# EAGLE design logicboard (EAGLE 6.6.0)
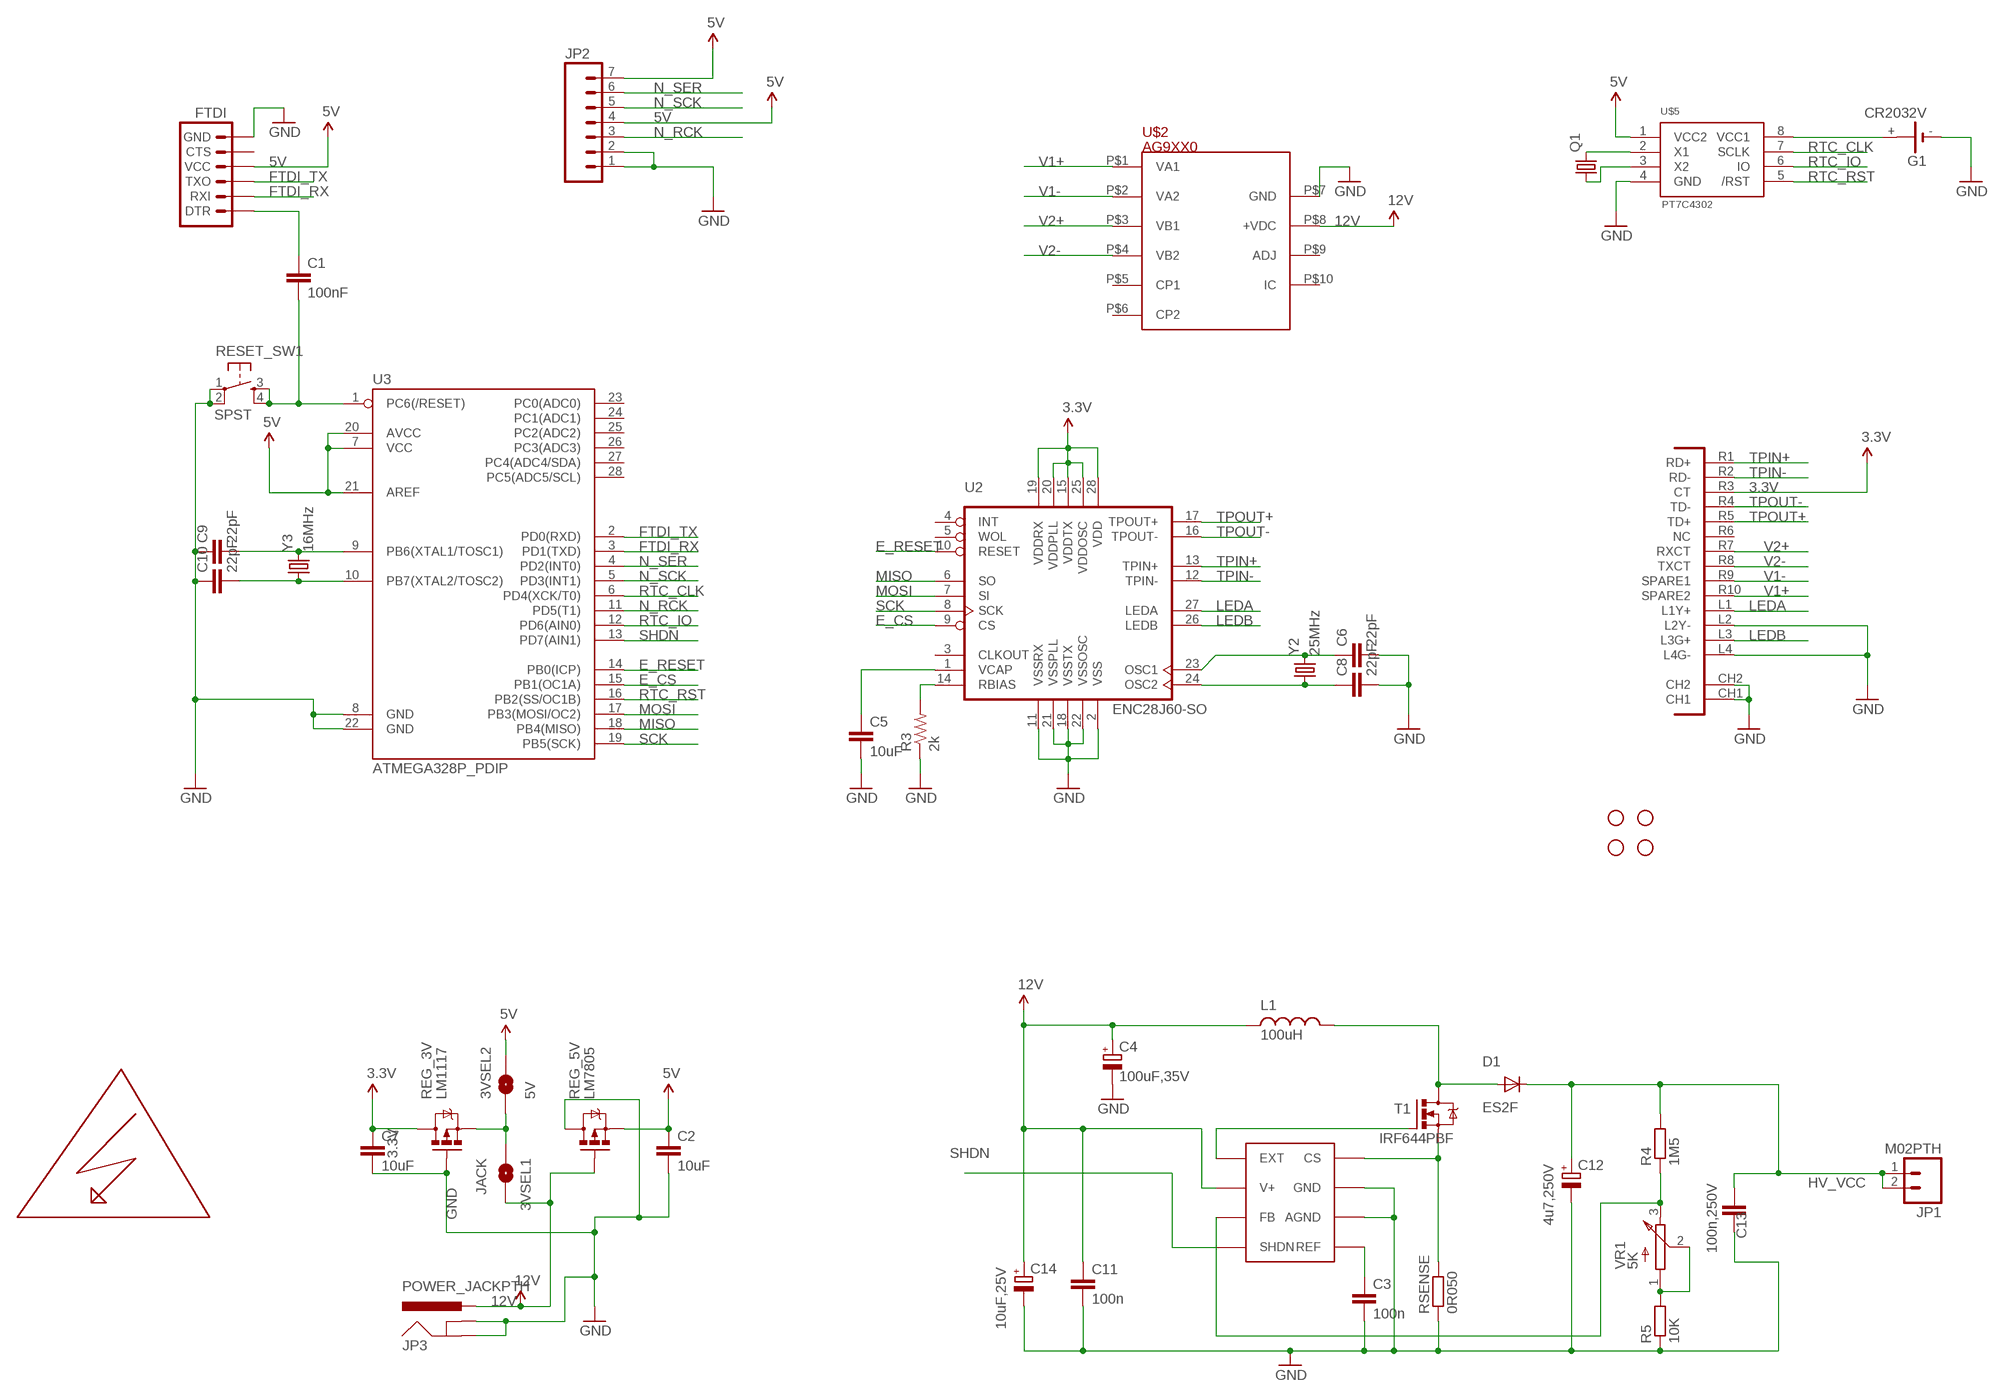
[diagram p0: schematic, sheet 1]

## Parts
3VSEL1  JACK  JUMPER-PAD-2-NOROUND  [PAD-JUMPER-2-NO_YES_SILK_ROUND]
3VSEL2  5V  JUMPER-PAD-2-NOROUND  [PAD-JUMPER-2-NO_YES_SILK_ROUND]
C1  100nF  CAPPTH  [CAP-PTH-SMALL]
C2  10uF  CAPPTH  [CAP-PTH-SMALL]
C3  100n  C-EUC0805  [C0805]
C4  100uF,35V  C-POL-EU7343  [C-EIA-7343]
C5  10uF  CAPPTH  [CAP-PTH-SMALL]
C6  22pF  CAPPTH  [CAP-PTH-SMALL]
C7  10uF  CAPPTH  [CAP-PTH-SMALL]
C8  22pF  CAPPTH  [CAP-PTH-SMALL]
C9  22pF  CAPPTH  [CAP-PTH-SMALL]
C10  22pF  CAPPTH  [CAP-PTH-SMALL]
C11  100n  C-EUC0805  [C0805]
C12  4u7,250V  C-POL-EU-NICHICON-UJ-12  [NICHICON-UJ-12]
C13  100n,250V  C-EU-2420  [C2420]
C14  10uF,25V  C-POL-EU7343  [C-EIA-7343]
D1  ES2F  DIODE-SMC  [SMC]
FTDI  ARDUINO_SERIAL_PROGRAMPTH  [1X06]
G1  CR2032V  [CR2032V]
JP1  M02PTH  [1X02]
JP2  M07  [1X07]
JP3  POWER_JACKPTH  [POWER_JACK_PTH]
L1  100uH  L-SMT-POWER-B82479  [L-B82479]
Q1  CRYSTALTC26V  [TC26V]
R3  2k  RESISTORPTH-1/4W-VERT  [AXIAL-0.1]
R4  1M5  R-EU_R2512  [R2512]
R5  10K  R-EU_R0805  [R0805]
REG_3V  LM1117  MOSFET-PCHANNELFQP27P06  [TO220V]
REG_5V  LM7805  MOSFET-PCHANNELFQP27P06  [TO220V]
RESET_SW1  SPST  TACTILE-SWITCH-PTH  [TAC-SWITCH-PTH]
RSENSE  0R050  R-EU_R2010  [R2010]
STANDOFF1  STAND-OFF  [STAND-OFF]
STANDOFF2  STAND-OFF  [STAND-OFF]
STANDOFF3  STAND-OFF  [STAND-OFF]
STANDOFF4  STAND-OFF  [STAND-OFF]
T1  IRF644PBF  IRF740  [TO220BV]
U2  ENC28J60-SO  [SO28W]
U3  ATMEGA328P_PDIP  [DIL28-3]
U$1  MAX1771  [8-DIP]
U$2  AG9XX0  [AG9000]
U$3  POE-RJ45  [POE-RJ45]
U$4  HIGHVOLTAGE  [HIGHVOLTAGE]
U$5  PT7C4302  [SO8]
VR1  5K  TRIMPOT-3214W  [BOURNS-3214W]
Y2  25MHz  CRYSTALHC49US  [HC49US]
Y3  16MHz  CRYSTALHC49US  [HC49US]

## Nets
3.3V: C7.1 REG_3V.2(D) U2.15(VDDTX) U2.19(VDDRX) U2.20(VDDPLL) U2.25(VDDOSC) U2.28(VDD) U$3.R3(CT)
5V: 3VSEL2.2 C2.1 FTDI.4(VCC) JP2.4 JP2.7 REG_5V.3(S) U3.7(VCC) U3.20(AVCC) U3.21(AREF) U$5.1(VCC2)
12V [power]: 3VSEL1.2 C4.+ C11.1 C14.+ JP3.PWR L1.P$1 REG_5V.1(G) U$1.V+ U$2.P$8(+VDC)
E_CS: U2.9(CS) U3.15(PB1(OC1A))
E_RESET: U2.10(RESET) U3.14(PB0(ICP))
EXT: T1.G U$1.EXT
FTDI_RX: FTDI.2(RXI) U3.3(PD1(TXD))
FTDI_TX: FTDI.3(TXO) U3.2(PD0(RXD))
GND: C2.2 C3.2 C4.- C5.2 C6.2 C7.2 C8.2 C9.1 C10.1 C11.2 C12.1(-) C13.P$2 C14.- FTDI.6(GND) G1.- JP2.1 JP2.2 JP3.GND JP3.GNDBREAK R3.P$1 R5.1 REG_3V.1(G) REG_5V.2(D) RESET_SW1.1 RESET_SW1.2 RSENSE.1 U2.2(VSS) U2.11(VSSRX) U2.18(VSSTX) U2.21(VSSPLL) U2.22(VSSOSC) U3.8(GND) U3.22(GND) U$1.AGND U$1.GND U$2.P$7(GND) U$3.CH1 U$3.CH2 U$3.L2(L2Y-) U$3.L4(L4G-) U$5.4(GND)
HV_VCC [power]: C12.2(+) C13.P$1 D1.C JP1.1 JP1.2 R4.2
LEDA: U2.27(LEDA) U$3.L1(L1Y+)
LEDB: U2.26(LEDB) U$3.L3(L3G+)
MISO: U2.6(SO) U3.18(PB4(MISO))
MOSI: U2.7(SI) U3.17(PB3(MOSI/OC2))
N$1: 3VSEL1.1 3VSEL2.1 REG_3V.3(S)
N$2: G1.+ U$5.8(VCC1)
N$3: R3.P$2 U2.14(RBIAS)
N$4: C5.1 U2.1(VCAP)
N$5: C6.1 U2.23(OSC1) Y2.2
N$6: C8.1 U2.24(OSC2) Y2.1
N$7: R5.2 VR1.1(A) VR1.2(W)
N$8: R4.1 U$1.FB VR1.3(B)
N$9: RSENSE.2 T1.S U$1.CS
N$10: C3.1 U$1.REF
N$11: Q1.2 U$5.2(X1)
N$12: Q1.1 U$5.3(X2)
N$15 [power]: D1.A L1.P$2 T1.D
N$20: C9.2 U3.9(PB6(XTAL1/TOSC1)) Y3.2
N$21: C10.2 U3.10(PB7(XTAL2/TOSC2)) Y3.1
N$37: C1.1 FTDI.1(DTR)
N_RCK: JP2.3 U3.11(PD5(T1))
N_SCK: JP2.5 U3.5(PD3(INT1))
N_SER: JP2.6 U3.4(PD2(INT0))
RESET: C1.2 RESET_SW1.3 RESET_SW1.4 U3.1(PC6(/RESET))
RTC_CLK: U3.6(PD4(XCK/T0)) U$5.7(SCLK)
RTC_IO: U3.12(PD6(AIN0)) U$5.6(IO)
RTC_RST: U3.16(PB2(SS/OC1B)) U$5.5(/RST)
SCK: U2.8(SCK) U3.19(PB5(SCK))
SHDN: U3.13(PD7(AIN1)) U$1.SHDN
TPIN+: U2.13(TPIN+) U$3.R1(RD+)
TPIN-: U2.12(TPIN-) U$3.R2(RD-)
TPOUT+: U2.17(TPOUT+) U$3.R5(TD+)
TPOUT-: U2.16(TPOUT-) U$3.R4(TD-)
V1+: U$2.P$1(VA1) U$3.R10(SPARE2)
V1-: U$2.P$2(VA2) U$3.R9(SPARE1)
V2+: U$2.P$3(VB1) U$3.R7(RXCT)
V2-: U$2.P$4(VB2) U$3.R8(TXCT)
Unconnected: FTDI.5(CTS) G1.+@1(+) U2.3(CLKOUT) U2.4(INT) U2.5(WOL) U3.23(PC0(ADC0)) U3.24(PC1(ADC1)) U3.25(PC2(ADC2)) U3.26(PC3(ADC3)) U3.27(PC4(ADC4/SDA)) U3.28(PC5(ADC5/SCL)) U$2.P$5(CP1) U$2.P$6(CP2) U$2.P$9(ADJ) U$2.P$10(IC) U$3.R6(NC)

## Library data of the parts
3VSEL1 3VSEL2 = SparkFun-Passives:JUMPER-PAD-2-NO
C1 C2 C5-C10 = SparkFun-Capacitors:CAP: Capacitor Standard 0603 ceramic capacitor, and 0.1" leaded capacitor.
C3 C11 = rcl:C-EU: CAPACITOR, European symbol
C4 C14 = nick:C-POL-EU7343: Capacitor, Tantalum, EU 7343 case, polarised
C12 = nick:C-POL-EU: Capacitor, Tantalum, EU 7343 case, polarised
C13 = nick:C-EU
D1 = diode:DIODE-: DIODE
FTDI = SparkFun-Connectors:ARDUINO_SERIAL_PROGRAM: FTDI connector footprints
G1 = battery:CR2032V: LI BATTERY Varta
JP1 = SparkFun-Connectors:M02: Standard 2-pin 0.1" header. Use with - straight break away headers ( PRT-00116) - right angle break away headers (PRT-00553) - swiss pins (PRT-00743) - machine pins (PRT-00117) - female headers (PRT-00115) Molex polarized connector foot print use with: PRT-08233 with associated crimp pins and housings. 2.54_SCREWTERM for use with PRT-10571. 3.5mm Screw Terminal footprints for PRT-08084 5mm Screw Terminal footprints for use with PRT-08432
JP2 = SparkFun-Connectors:M07: Header 7 Standard 7-pin 0.1" header. Use with straight break away headers (SKU : PRT-00116), right angle break away headers (PRT-00553), swiss pins (PRT-00743), machine pins (PRT-00117), and female headers (PRT-00115). NOTES ON THE VARIANTS LOCK and LOCK_LONGPADS... This footprint was designed to help hold the alignment of a through-hole component (i.e. 7-pin header) while soldering it into place. You may notice that each hole has been shifted either up or down by 0.005 of an inch from it's more standard position (which is usually a perfectly straight line). This slight alteration caused the pins (the squares in the middle) to touch the edges of the holes. Because they are alternating, it causes a "brace" to hold the header in place. 0.005 has proven to be the perfect amount of "off-center" position when using our standard breakaway headers. Although looks a little odd when you look at the bare footprint, once you have a header in there, the alteration is very hard to notice. Also, if you push a header all the way into place, it is covered up entirely on the bottom side. This idea of altering the position of holes to aid alignment will be further integrated into the Sparkfun Library for other footprints. It can help hold any component with 3 or more connection pins.
JP3 = SparkFun-Connectors:POWER_JACK: Power Jack This is the standard 5.5mm barrel jack for power. The PTH is the most common, proven, reliable, footprint. The Slot footprint only works if the mill layer is transmitted to the PCB fab house so be warned. Mating wall wart : TOL-00298 (and others); PROD_ID: CONN-08197
L1 = nick:L-SMT-POWER: SMT power inductors
Q1 = crystal:CRYSTAL: CRYSTAL; OC_FARNELL: unknown; OC_NEWARK: unknown
R3 = SparkFun-Resistors:RESISTOR: Resistor Basic schematic elements and footprints for 0603, 1206, and PTH resistors.
R4 R5 RSENSE = rcl:R-EU_: RESISTOR, European symbol
REG_3V REG_5V = User-Submitted:MOSFET-PCHANNEL: Generic PMOSFET IRLML2244 - TRANS-11153 (SOT-23 -20V -4.3A) (1.Gate 2.Source 3.Drain) FQP27P06 - COM-10349 <http://www.sparkfun.com/products/10349> (TO-220 -60V -27A) (1.Gate 2.Source 3.Drain)
RESET_SW1 = GeekAmmo:TACTILE-SWITCH: Tactile Switch 4 Pins, SPST NO
STANDOFF1-STANDOFF4 = SparkFun-Electromechanical:STAND-OFF: #4 Stand Off This is the mechanical footprint for a #4 phillips button head screw. Use the keepout ring to avoid running the screw head into surrounding components. SKU : PRT-00447
T1 = transistor-power:IRF740: N-CHANNEL MOS FET
U2 = microchip-enc28j60:ENC28J60-*: Microchip 10Mbit Eth. contoller with SPI interface
U3 = SparkFun-DigitalIC:ATMEGA328P_PDIP: uC used in the Arduino 32kb flash, 1k EEPROM, 2k SRAM This is the through-hole version of this chip.
U$1 = max1771:MAX1771
U$2 = SmartPrj:AG9XX0: PoE module
U$3 = SmartPrj:POE-RJ45
U$4 = highvoltage:HIGHVOLTAGE
U$5 = Custom:PT7C4302
VR1 = nick:TRIMPOT
Y2 Y3 = SparkFun-FreqCtrl:CRYSTAL: Various standard crystals. Proven footprints.

## Net classes
1 power: width 0.762 mm, clearance 0.508 mm

## Board
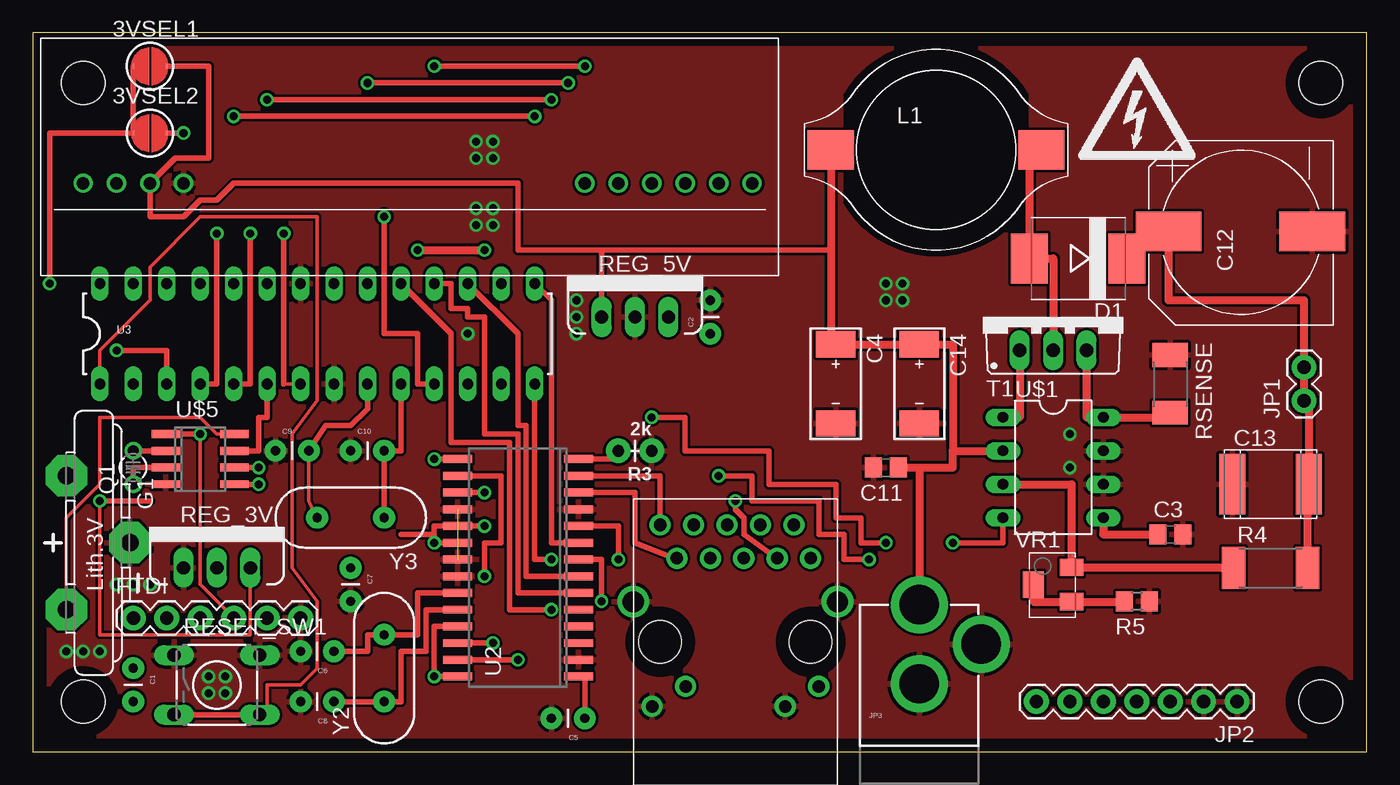
[diagram p1: board, top side]
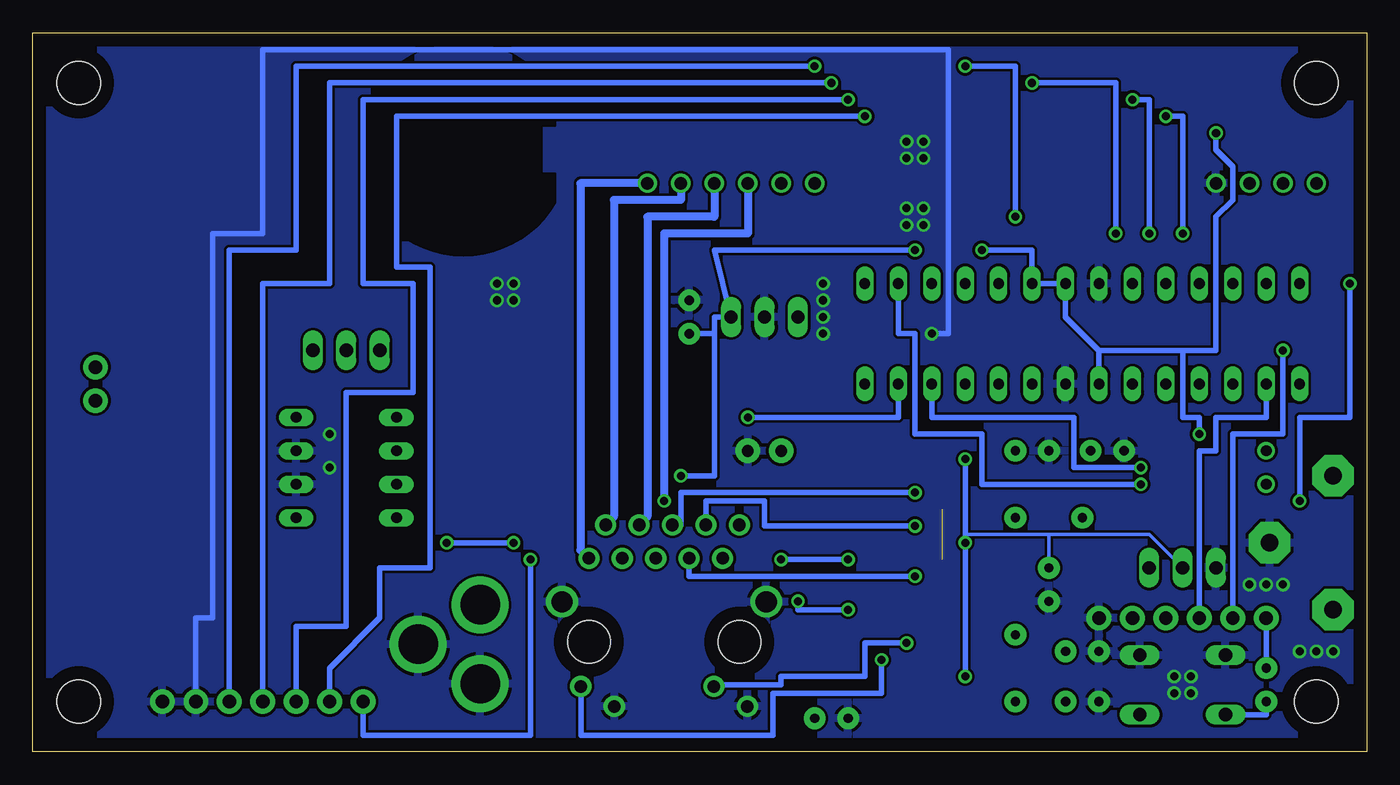
[diagram p2: board, bottom side, seen from below]

Size 101.27 x 54.6 mm. Coordinates in mm from the lower left corner, seen from the top.
Outline: 0,0 101.27,0 101.27,54.6 0,54.6 0,0
Copper layers (1*16): Top 0.035mm / dielectric 1.5mm / Bottom 0.035mm
Design rules "default": minimum track width 10mil, minimum drill 24mil, track to track 8mil, track to pad 8mil, pad to pad 8mil, via to via 8mil, smd to smd 8mil, copper to edge 40mil, drill to drill 8mil, minimum pad ring 10mil, minimum via ring 8mil, stop-mask expansion 4mil, vias tented up to drill 0mil, thermal gap 10mil

### Footprints (pad centres in the part's own frame; a part is rotated, then mirrored left to right if it is on the bottom)
PAD-JUMPER-2-NO_YES_SILK_ROUND = smd 0.152 x 0.305: 1 -1.27,0; 2 1.27,0
CAP-PTH-SMALL = drill 0.7 pad 1.651: 1 0,0; 2 2.54,0
C0805 = smd 1.3 x 1.5: 1 -0.95,0; 2 0.95,0
C-EIA-7343 = smd 2 x 3: + -3,0; - 3,0
NICHICON-UJ-12 = smd 3 x 5: 1 -2.4,-7.6; 2 -2.4,3.3
C2420 = smd 2 x 4.6: P$1 2.9,0; P$2 -2.9,0
SMC = smd 2.8 x 3.8: A 3.7,0; C -3.7,0
1X06 = drill 1.016 pad 1.88: 1 0,0; 2 2.54,0; 3 5.08,0; 4 7.62,0; 5 10.16,0; 6 12.7,0
CR2032V = drill 1.321 pad 3.15 octagon: + -2.54,-5.08; +@1 -2.54,5.08; - 2.286,0
1X02 = drill 1.016 pad 1.88: 1 0,0; 2 2.54,0
1X07 = drill 1.016 pad 1.88: 1 0,0; 2 2.54,0; 3 5.08,0; 4 7.62,0; 5 10.16,0; 6 12.7,0; 7 15.24,0
POWER_JACK_PTH = drill 2.997 pad 4.318: GND 0,7.7; GNDBREAK 4.7,10.7; PWR 0,13.7
L-B82479 = smd 3.5 x 3: P$1 -8,0; P$2 8,0
TC26V = drill 0.813: 1 -1.27,0; 2 1.27,0
AXIAL-0.1 = drill 0.9 pad 1.88: P$1 0,0; P$2 2.54,0
R2512 = smd 1.8 x 3.2: 1 -2.8,0; 2 2.8,0
R0805 = smd 1.3 x 1.5: 1 -0.95,0; 2 0.95,0
TO220V = drill 1.016 long: 1 -2.54,0; 2 0,0; 3 2.54,0
TAC-SWITCH-PTH = drill 1.016 pad 1.524 long: 1 -3.251,2.261; 2 3.251,2.261; 3 -3.251,-2.261; 4 3.251,-2.261
R2010 = smd 1.8 x 2.7: 1 -2.2,0; 2 2.2,0
STAND-OFF = hole 3.302: 0,0
TO220BV = drill 1.016 long: D 0,-2.54; G -2.54,-2.54; S 2.54,-2.54
SO28W = smd 0.6 x 2.2: 1 -8.255,-4.6; 2 -6.985,-4.6; 3 -5.715,-4.6; 4 -4.445,-4.6; 5 -3.175,-4.6; 6 -1.905,-4.6; 7 -0.635,-4.6; 8 0.635,-4.6; 9 1.905,-4.6; 10 3.175,-4.6; 11 4.445,-4.6; 12 5.715,-4.6; 13 6.985,-4.6; 14 8.255,-4.6; 15 8.255,4.6; 16 6.985,4.6; 17 5.715,4.6; 18 4.445,4.6; 19 3.175,4.6; 20 1.905,4.6; 21 0.635,4.6; 22 -0.635,4.6; 23 -1.905,4.6; 24 -3.175,4.6; 25 -4.445,4.6; 26 -5.715,4.6; 27 -6.985,4.6; 28 -8.255,4.6
DIL28-3 = drill 0.813 long: 1 -16.51,-3.81; 2 -13.97,-3.81; 3 -11.43,-3.81; 4 -8.89,-3.81; 5 -6.35,-3.81; 6 -3.81,-3.81; 7 -1.27,-3.81; 8 1.27,-3.81; 9 3.81,-3.81; 10 6.35,-3.81; 11 8.89,-3.81; 12 11.43,-3.81; 13 13.97,-3.81; 14 16.51,-3.81; 15 16.51,3.81; 16 13.97,3.81; 17 11.43,3.81; 18 8.89,3.81; 19 6.35,3.81; 20 3.81,3.81; 21 1.27,3.81; 22 -1.27,3.81; 23 -3.81,3.81; 24 -6.35,3.81; 25 -8.89,3.81; 26 -11.43,3.81; 27 -13.97,3.81; 28 -16.51,3.81
8-DIP = drill 0.813 long: AGND 6.35,3.81; CS 1.27,3.81; EXT 1.27,-3.81; FB 6.35,-3.81; GND 3.81,3.81; REF 8.89,3.81; SHDN 8.89,-3.81; V+ 3.81,-3.81
AG9000 = drill 0.95 pad 1.422: P$1 0,0; P$2 2.54,0; P$3 5.08,0; P$4 7.62,0; P$5 10.16,0; P$6 12.7,0; P$7 43.18,0; P$8 45.72,0; P$9 48.26,0; P$10 50.8,0
POE-RJ45 = drill 1.6: CH1 13.94,7.75; CH2 13.94,-7.75 | drill 0.95 pad 1.6: L1 7.51,-6.325; L2 5.99,-3.785; L3 7.51,3.785; L4 5.99,6.325; R1 19.77,5.715; R2 17.23,4.445; R3 19.77,3.175; R4 17.23,1.905; R5 19.77,0.635; R6 17.23,-0.635; R7 19.77,-1.905; R8 17.23,-3.175; R9 19.77,-4.445; R10 17.23,-5.715 | hole 3.25: 10.89,5.715; 10.89,-5.715
SO8 = smd 0.6 x 2.2: 1 1.27,-0.695; 2 2.54,-0.695; 3 3.81,-0.695; 4 5.08,-0.695; 5 5.08,4.505; 6 3.81,4.505; 7 2.54,4.505; 8 1.27,4.505
BOURNS-3214W = smd 1.8 x 1.3: 1 1.4,-1.3; 3 1.4,1.3 | smd 1.6 x 2: 2 -1.5,0
HC49US = drill 0.7 pad 1.651: 1 -2.54,0; 2 2.54,0

### Placement (x,y rotation side)
3VSEL1  8.89,52.07 0 top
3VSEL2  8.89,46.99 0 top
C1  7.62,6.35 270 top
C2  51.44,31.75 90 top
C3  86.36,16.51 0 top
C4  60.96,27.94 270 top
C5  41.91,2.54 180 top
C6  22.86,7.62 180 top
C7  24.13,13.97 270 top
C8  22.86,3.81 180 top
C9  18.41,22.86 0 top
C10  24.13,22.86 0 top
C11  64.77,21.59 180 top
C12  89.53,41.91 90 top
C13  93.98,20.32 0 top
C14  67.31,27.94 270 top
D1  79.38,37.47 180 top
FTDI  7.62,10.16 0 top
G1  5.08,15.88 0 top
JP1  96.52,26.67 90 top
JP2  91.44,3.81 180 top
JP3  67.31,-2.54 0 top
L1  68.58,45.72 0 top
Q1  7.62,21.59 90 top
R3  46.99,22.86 180 top
R4  93.98,13.97 0 top
R5  83.82,11.43 180 top
REG_3V  13.97,13.97 0 top
REG_5V  45.72,33.02 0 top
RESET_SW1  13.97,5.08 0 top
RSENSE  86.36,27.94 270 top
STANDOFF1  97.79,50.8 0 top
STANDOFF2  97.79,3.81 0 top
STANDOFF3  3.81,3.81 0 top
STANDOFF4  3.81,50.8 0 top
T1  77.47,33.02 0 top
U2  36.83,13.97 90 top
U3  21.59,31.75 0 top
U$1  77.47,26.67 270 top
U$2  54.61,43.18 180 top
U$3  53.34,-2.54 90 top
U$4  79.38,44.45 0 top
U$5  10.79,25.4 270 top
VR1  77.47,12.7 0 top
Y2  26.67,6.35 90 top
Y3  24.13,17.78 180 top

### Tracks (layer width: path | path; a pad name or v marks a point on that pad's centre or on a via)
3.3V  (via drill 0.61)
  Top 0.406: U2.28 v30.48,5.71 30.48,9.53 U2.25 | U2.20 v30.48,15.88 30.48,16.51 | 30.48,16.51 30.48,17.14 U2.19 v34.29,17.14 | U2.15 v30.48,22.23 | 27.94,16.51 30.48,16.51
  Bottom 0.254: REG_3V.2 16.51,16.51 24.13,16.51 | 30.48,16.51 24.13,16.51 | 24.13,16.51 C7.1
  Bottom 0.406: v30.48,5.71 v30.48,15.88 30.48,16.51 v30.48,22.23 | v34.29,17.14 45.72,17.14 45.72,19.05 50.16,19.05 U$3.R3
5V  (via drill 0.61)
  Top 0.254: FTDI.4 12.7,12.7 v12.7,24.13 | 19.05,27.94 U3.7
  Top 0.406: v52.07,20.95 54.61,20.95 54.61,19.05 59.69,19.05 59.69,16.51 61.59,16.51 61.59,14.61 v63.5,14.61 | v11.43,46.99 3VSEL2.2 | 19.05,27.94 v19.05,39.37 | v25.4,50.8 v40.64,50.8 | U$5.1 v12.7,24.13
  Top 0.61: v29.21,38.1 v34.29,38.1
  Bottom 0.406: v52.07,20.95 49.53,20.95 49.53,31.75 | v12.7,24.13 12.7,25.4 13.97,25.4 13.97,30.48 | 13.97,30.48 20.32,30.48 | U3.7 20.32,30.48 | 20.32,30.48 22.86,33.02 U3.21 U3.20 25.4,38.1 v29.21,38.1 | v34.29,38.1 49.53,38.1 REG_5V.3 49.53,33.02 49.53,31.75 | JP2.7 76.2,1.27 63.5,1.27 v63.5,14.61 | 13.97,30.48 11.43,30.48 11.43,40.64 10.16,41.91 10.16,44.45 11.43,45.72 v11.43,46.99 | v19.05,39.37 19.05,50.8 v25.4,50.8 | v40.64,50.8 78.74,50.8 78.74,35.56 83.82,35.56 JP2.4 | C2.1 49.53,31.75
12V
  Top 0.406: 43.18,38.1 60.58,38.1 | REG_5V.1 43.18,38.1 | 43.18,38.1 36.83,38.1 36.83,43.18 15.24,43.18 13.97,41.91 12.7,41.91 11.43,40.64 8.89,40.64 U$2.P$8 10.79,45.09 13.34,45.09 13.34,52.07 3VSEL1.2
  Top 0.61: L1.P$1 60.58,38.1 60.58,30.94 C4.+ C14.+ 69.85,30.94 69.85,22.86 | 69.85,22.86 U$1.V+ | JP3.PWR 67.31,21.59 C11.1 69.85,21.59 69.85,22.86
E_CS
  Top 0.406: U3.15 39.37,34.29 39.37,15.88 U2.9
E_RESET  (via drill 0.61)
  Top 0.406: U3.14 38.1,14.61 v39.37,14.61 | v44.45,14.61 44.45,17.14 U2.10
  Bottom 0.406: v39.37,14.61 v44.45,14.61
EXT
  Top 0.61: T1.G 74.93,25.4 U$1.EXT
FTDI_RX  (via drill 0.61)
  Top 0.406: v6.35,30.48 10.16,30.48 U3.3
  Bottom 0.406: v6.35,30.48 6.35,24.13 10.16,24.13 FTDI.2
FTDI_TX
  Bottom 0.406: U3.2 7.62,25.4 11.43,25.4 11.43,22.86 12.7,22.86 FTDI.3
GND  (via drill 0.61)  (1 unrouted)
  Bottom 0.406: v33.02,31.75 31.75,31.75 31.75,53.34 83.82,53.34 83.82,39.37 87.63,39.37 87.63,10.16 88.9,10.16 JP2.2
  other vias: 33.66,46.35 34.92,46.35 34.92,45.09 33.66,45.09 33.66,41.27 34.92,41.27 33.66,40.01 34.92,40.01 78.74,24.13 78.74,21.59 41.27,35.56 41.27,34.29 41.27,33.02 41.27,31.75 66.04,35.56 66.04,34.29 64.77,35.56 64.77,34.29 6.35,12.7 7.62,12.7 8.89,12.7 2.54,7.62 3.81,7.62 5.08,7.62 13.34,5.71 14.61,5.71 14.61,4.45 13.34,4.45
  pour Top: 0,0 101.6,0 101.6,54.61 0,54.61
  pour Bottom: 0,0 101.6,0 101.6,54.61 0,54.61
HV_VCC
  Top 0.406: JP1.1 96.88,26.67
  Top 0.61: D1.C 84.98,39.51 C12.2 86.23,34.29 96.52,34.29 JP1.2 JP1.1 | R4.2 96.78,20.32 C13.P$1 96.88,26.67
LEDA  (via drill 0.61)
  Top 0.406: U2.27 v36.83,6.99
  Bottom 0.406: v36.83,6.99 36.83,4.45 45.09,4.45 45.09,1.27 59.66,1.27 U$3.L1
LEDB  (via drill 0.61)
  Top 0.406: U2.26 v34.92,8.26
  Bottom 0.406: v34.92,8.26 38.1,8.26 38.1,5.71 44.45,5.71 44.45,5.08 49.55,5.08 U$3.L3
MISO
  Top 0.406: U2.6 36.83,12.06 36.83,24.13 34.29,24.13 34.29,33.02 33.02,33.02 33.02,33.66 31.75,33.66 31.75,35.56 U3.18
MOSI
  Top 0.406: U3.17 36.83,31.75 36.83,24.77 37.47,24.77 37.47,13.34 U2.7
N$1  (via drill 0.61)
  Top 0.254: REG_3V.3 16.51,8.89 5.08,8.89 v5.08,19.05
  Top 0.406: 3VSEL1.1 3VSEL2.1 1.27,46.99 v1.27,35.56 | v5.08,19.05 8.89,19.05
  Bottom 0.406: v5.08,19.05 5.08,25.4 1.27,25.4 v1.27,35.56
N$2
  Top 0.254: G1.+ 2.54,17.78 5.08,20.32 5.08,25.4 12.7,25.4 13.97,24.13 U$5.8
N$3
  Top 0.406: U2.14 44.45,22.23 R3.P$2
N$4
  Top 0.406: U2.1 41.91,5.71 C5.1
N$5
  Top 0.406: U2.23 29.21,12.06 29.21,8.89 Y2.2 25.4,8.89 25.4,7.62 C6.1
N$6
  Top 0.406: U2.24 29.84,10.79 29.84,7.62 27.94,7.62 27.94,3.81 Y2.1 C8.1
N$7
  Top 0.61: R5.2 82.87,11.4 VR1.1 75.97,11.4 VR1.2
N$8
  Top 0.61: U$1.FB 78.87,20.32 VR1.3 91.18,14 R4.1
N$9
  Top 0.61: T1.S 80.01,25.4 U$1.CS 86.36,25.4 RSENSE.2
N$10
  Top 0.61: U$1.REF 81.28,16.51 C3.1
N$11
  Top 0.406: Q1.2 U$5.2
N$12
  Top 0.406: Q1.1 7.62,21.59 U$5.3
N$15
  Top 0.61: L1.P$2 75.67,45.72 D1.A 77.47,37.47 T1.D
N$20
  Top 0.254: Y3.2 20.95,19.05 C9.2
  Top 0.406: C9.2 22.23,24.77 24.13,24.77 25.4,26.04 U3.9
N$21
  Top 0.406: U3.10 27.94,22.86 C10.2 Y3.1
N$37
  Bottom 0.406: C1.1 FTDI.1
N_RCK  (via drill 0.61)
  Top 0.406: U3.11 29.21,27.94 29.21,31.75 26.67,31.75 v26.67,40.64 | v30.48,52.07 v41.91,52.07
  Bottom 0.406: v26.67,40.64 26.67,52.07 v30.48,52.07 | v41.91,52.07 81.28,52.07 81.28,38.1 86.36,38.1 JP2.3
N_SCK  (via drill 0.61)
  Top 0.406: U3.5 16.51,27.94 v16.51,39.37 | v17.78,49.53 v39.37,49.53
  Bottom 0.406: v16.51,39.37 16.51,49.53 v17.78,49.53 | v39.37,49.53 76.2,49.53 76.2,35.56 72.39,35.56 72.39,27.3 77.47,27.3 77.47,9.53 81.28,9.53 JP2.5
N_SER  (via drill 0.61)
  Top 0.406: U3.4 13.97,27.94 v13.97,39.37 | v15.24,48.26 v38.1,48.26
  Bottom 0.406: v13.97,39.37 13.97,48.26 v15.24,48.26 | v38.1,48.26 73.66,48.26 73.66,36.83 71.12,36.83 71.12,13.97 74.93,13.97 74.93,10.16 78.74,6.35 JP2.6
RESET
  Top 0.254: U3.1 5.08,30.48 8.89,34.29 8.89,36.83 12.7,40.64 21.59,40.64 21.59,26.67 19.68,24.13 19.68,13.97 21.59,11.43 21.59,6.35 20.32,5.08 17.78,5.08 17.78,2.54 RESET_SW1.4
  Top 0.406: RESET_SW1.3 RESET_SW1.4
  Bottom 0.406: C1.2 7.62,2.82 RESET_SW1.3
RTC_CLK
  Top 0.406: U$5.7 17.14,22.86 17.14,25.4 17.78,25.4 U3.6
RTC_IO  (via drill 0.61)
  Top 0.406: U$5.6 v17.14,21.59
  Bottom 0.406: v17.14,21.59 22.23,21.59 22.23,25.4 33.02,25.4 U3.12
RTC_RST  (via drill 0.61)
  Top 0.406: U$5.5 v17.14,20.32
  Bottom 0.406: v17.14,20.32 29.21,20.32 29.21,24.13 34.29,24.13 34.29,31.75 35.56,31.75 U3.16
SCK  (via drill 0.61)
  Top 0.406: U3.19 31.75,31.75 31.75,23.5 36.2,23.5 36.2,10.79 v39.37,10.79 | U2.8 43.18,14.61 v43.18,11.43
  Bottom 0.406: v39.37,10.79 43.18,10.79 v43.18,11.43
SHDN  (via drill 0.61)
  Top 0.406: v64.77,15.88 62.87,15.88 62.87,17.78 60.96,17.78 60.96,20.32 55.88,20.32 55.88,22.86 49.53,22.86 49.53,25.4 v46.99,25.4 | U$1.SHDN 73.66,15.88 v69.85,15.88
  Bottom 0.406: v64.77,15.88 v69.85,15.88 | U3.13 35.56,25.4 v46.99,25.4
TPIN+
  Top 0.406: U2.13 47.62,20.95 U$3.R1
TPIN-
  Top 0.406: U2.12 45.72,19.68 45.72,15.88 48.9,14.61 U$3.R2
TPOUT+  (via drill 0.61)
  Top 0.406: U2.17 v34.29,19.68
  Bottom 0.406: v34.29,19.68 52.07,19.68 52.07,17.23 U$3.R5
TPOUT-  (via drill 0.61)
  Top 0.406: U2.16 35.56,20.95 35.56,15.88 34.29,15.88 v34.29,13.34
  Bottom 0.406: U$3.R4 51.44,13.34 v34.29,13.34
V1+
  Bottom 0.61: U$2.P$1 59.69,43.18 59.69,15.32 U$3.R10
V1-
  Bottom 0.61: U$2.P$2 52.07,41.91 57.15,41.91 57.15,17.86 U$3.R9
V2+
  Bottom 0.61: U$2.P$3 49.53,40.64 54.61,40.64 54.61,17.86 U$3.R7
V2-  (via drill 0.61)
  Top 0.406: v53.34,19.05 53.34,18.41 53.98,17.78 53.98,16.51 U$3.R8
  Bottom 0.61: U$2.P$4 46.99,39.37 53.34,39.37 v53.34,19.05